# EAGLE schematic EK-TM4C1294XL REV D-shield (EAGLE 6.5.0)

## Sheet 1 of 2: BoosterPack Interface
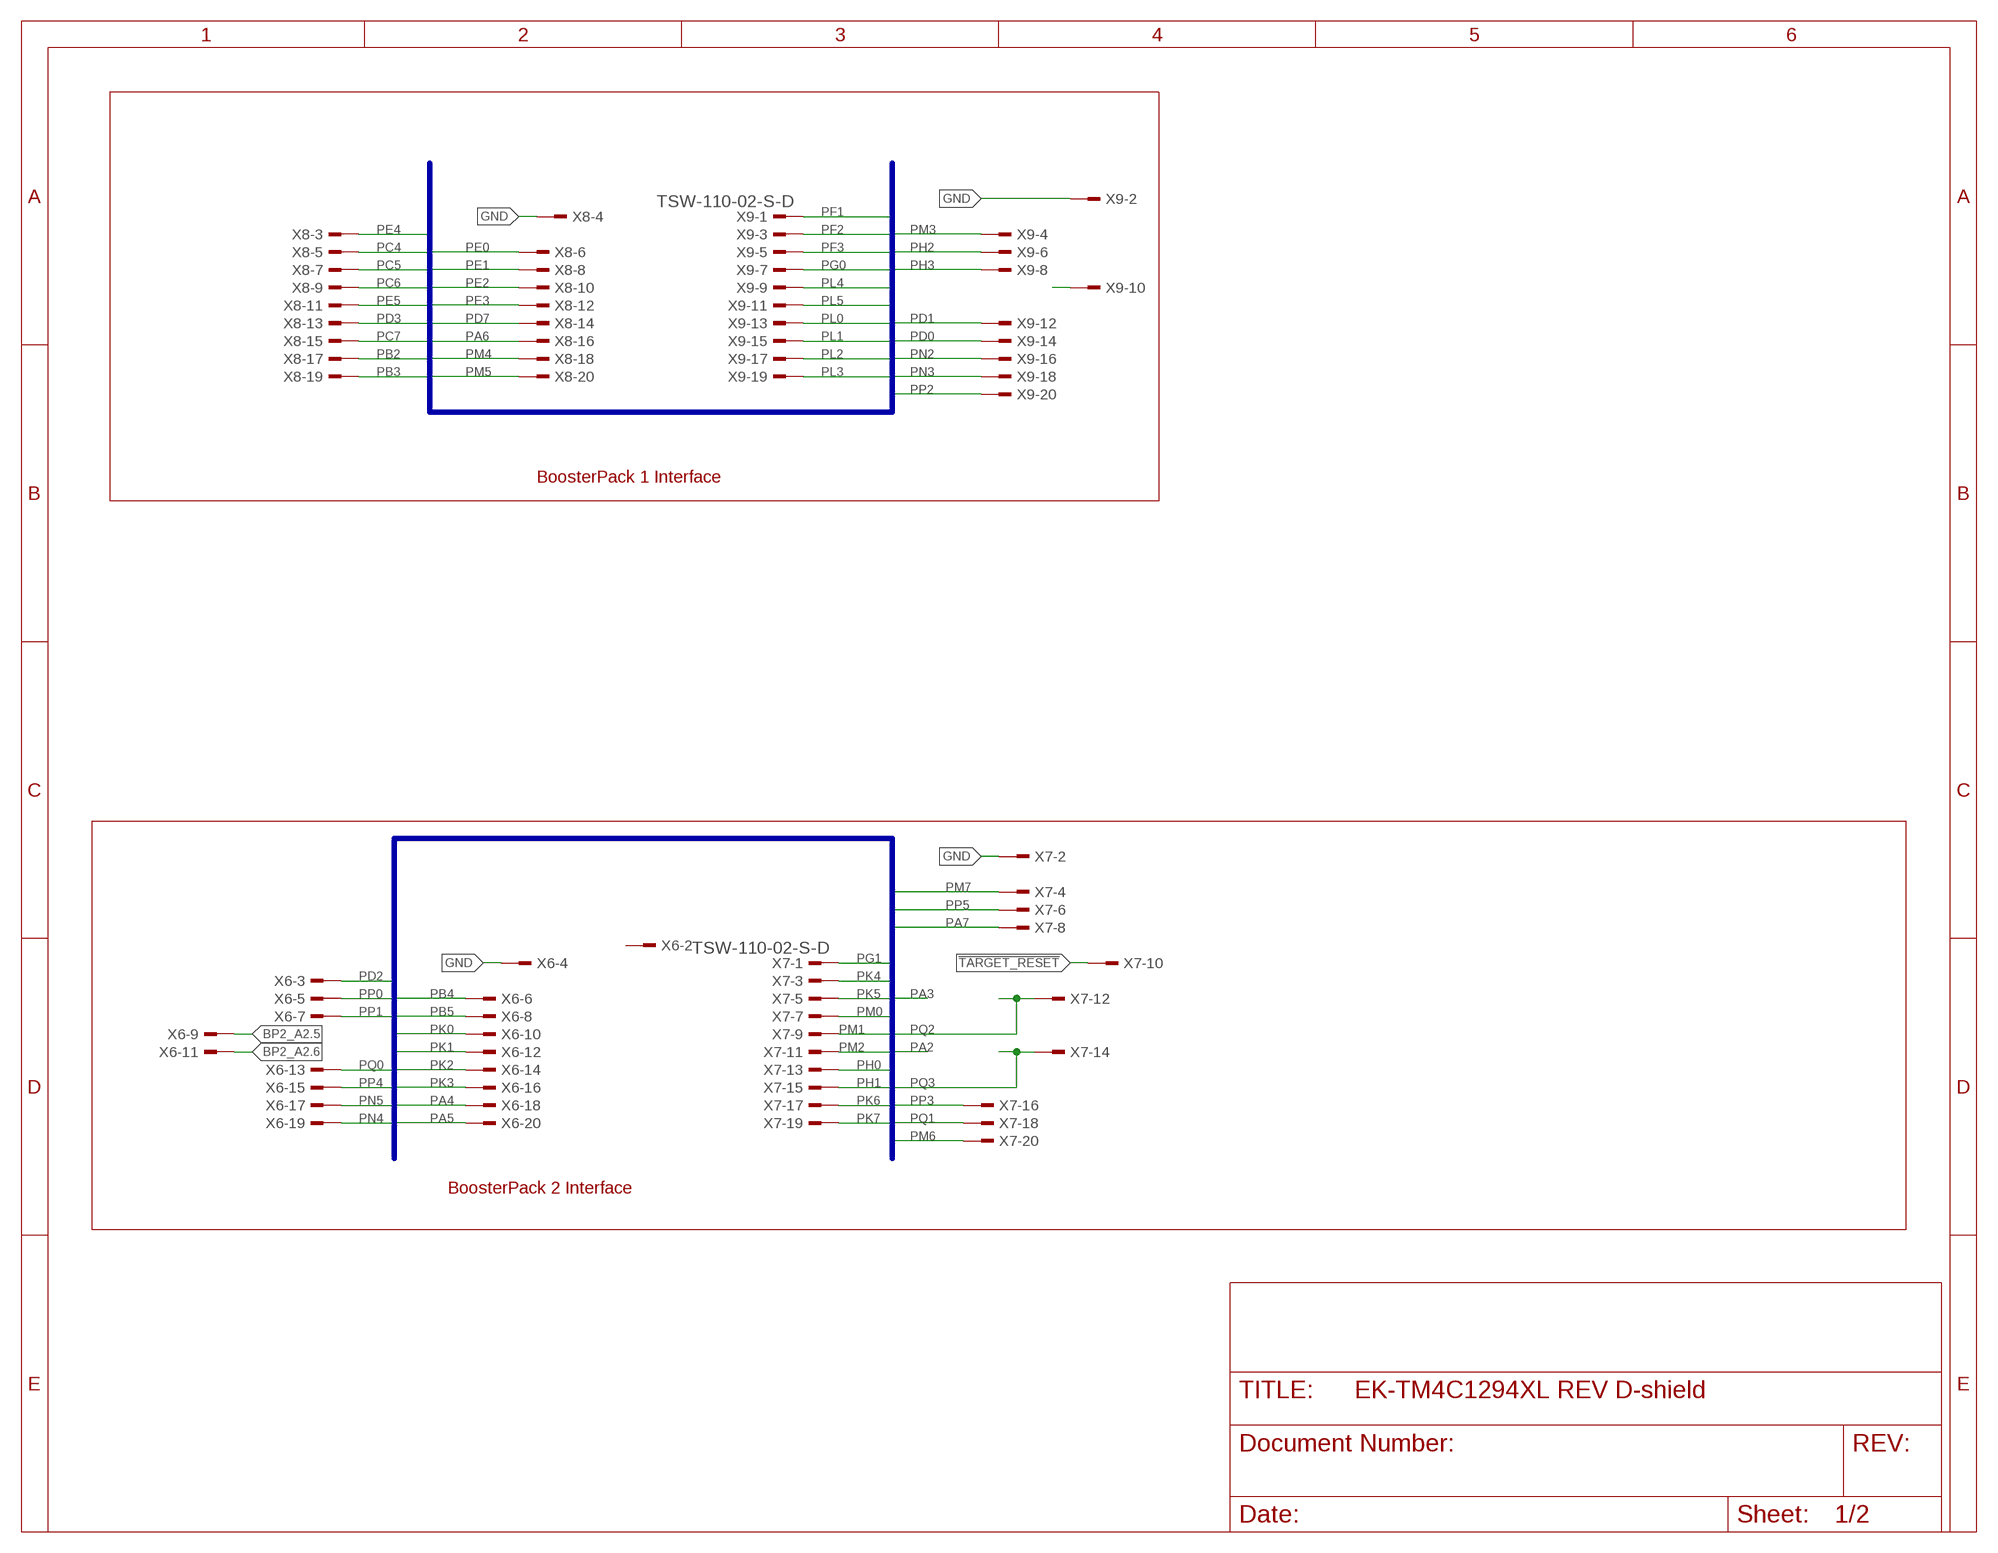
[diagram p0: schematic, sheet 1]

### Parts
X6  TSW-110-02-S-D  [TSW-110-02-S-D]
X7  TSW-110-02-S-D  [TSW-110-02-S-D]
X8  TSW-110-02-S-D  [TSW-110-02-S-D]
X9  TSW-110-02-S-D  [TSW-110-02-S-D]

### Nets
!TARGET_RESET: X7.10 X9.10
BP2_A2.5: X6.9
BP2_A2.6: X6.11
GND: X6.4 X7.2 X8.4 X9.2
PA4: X6.18
PA5: X6.20
PA6: X8.16
PA7: X7.8
PB2: X8.17
PB3: X8.19
PB4: X6.6
PB5: X6.8
PC4: X8.5
PC5: X8.7
PC6: X8.9
PC7: X8.15
PD0: X9.14
PD1: X9.12
PD2: X6.3
PD3: X8.13
PD7: X8.14
PE0: X8.6
PE1: X8.8
PE2: X8.10
PE3: X8.12
PE4: X8.3
PE5: X8.11
PF1: X9.1
PF2: X9.3
PF3: X9.5
PG0: X9.7
PG1: X7.1
PH0: X7.13
PH1: X7.15
PH2: X9.6
PH3: X9.8
PK0: X6.10
PK1: X6.12
PK2: X6.14
PK3: X6.16
PK4: X7.3
PK5: X7.5
PK6: X7.17
PK7: X7.19
PL0: X9.13
PL1: X9.15
PL2: X9.17
PL3: X9.19
PL4: X9.9
PL5: X9.11
PM0: X7.7
PM1: X7.9
PM2: X7.11
PM3: X9.4
PM4: X8.18
PM5: X8.20
PM6: X7.20
PM7: X7.4
PN2: X9.16
PN3: X9.18
PN4: X6.19
PN5: X6.17
PP0: X6.5
PP1: X6.7
PP2: X9.20
PP3: X7.16
PP4: X6.15
PP5: X7.6
PQ0: X6.13
PQ1: X7.18
PQ2: X7.12
PQ3: X7.14
Unconnected: X6.1 X6.2 X8.1 X8.2

### Buses
GPIO:PA[0..7],PB[0..5],PC[0..7],PD[0..7],PE[0..5],PF[0..4],PG[0..1],PH[0..3],PJ[0..1],PK[0..7],PL[0..7],PM[0..7],PN[0..5],PP[0..5],PQ[0..4]

### Notes on the sheet
- BoosterPack 1 Interface
- BoosterPack 2 Interface

## Sheet 2 of 2: Power
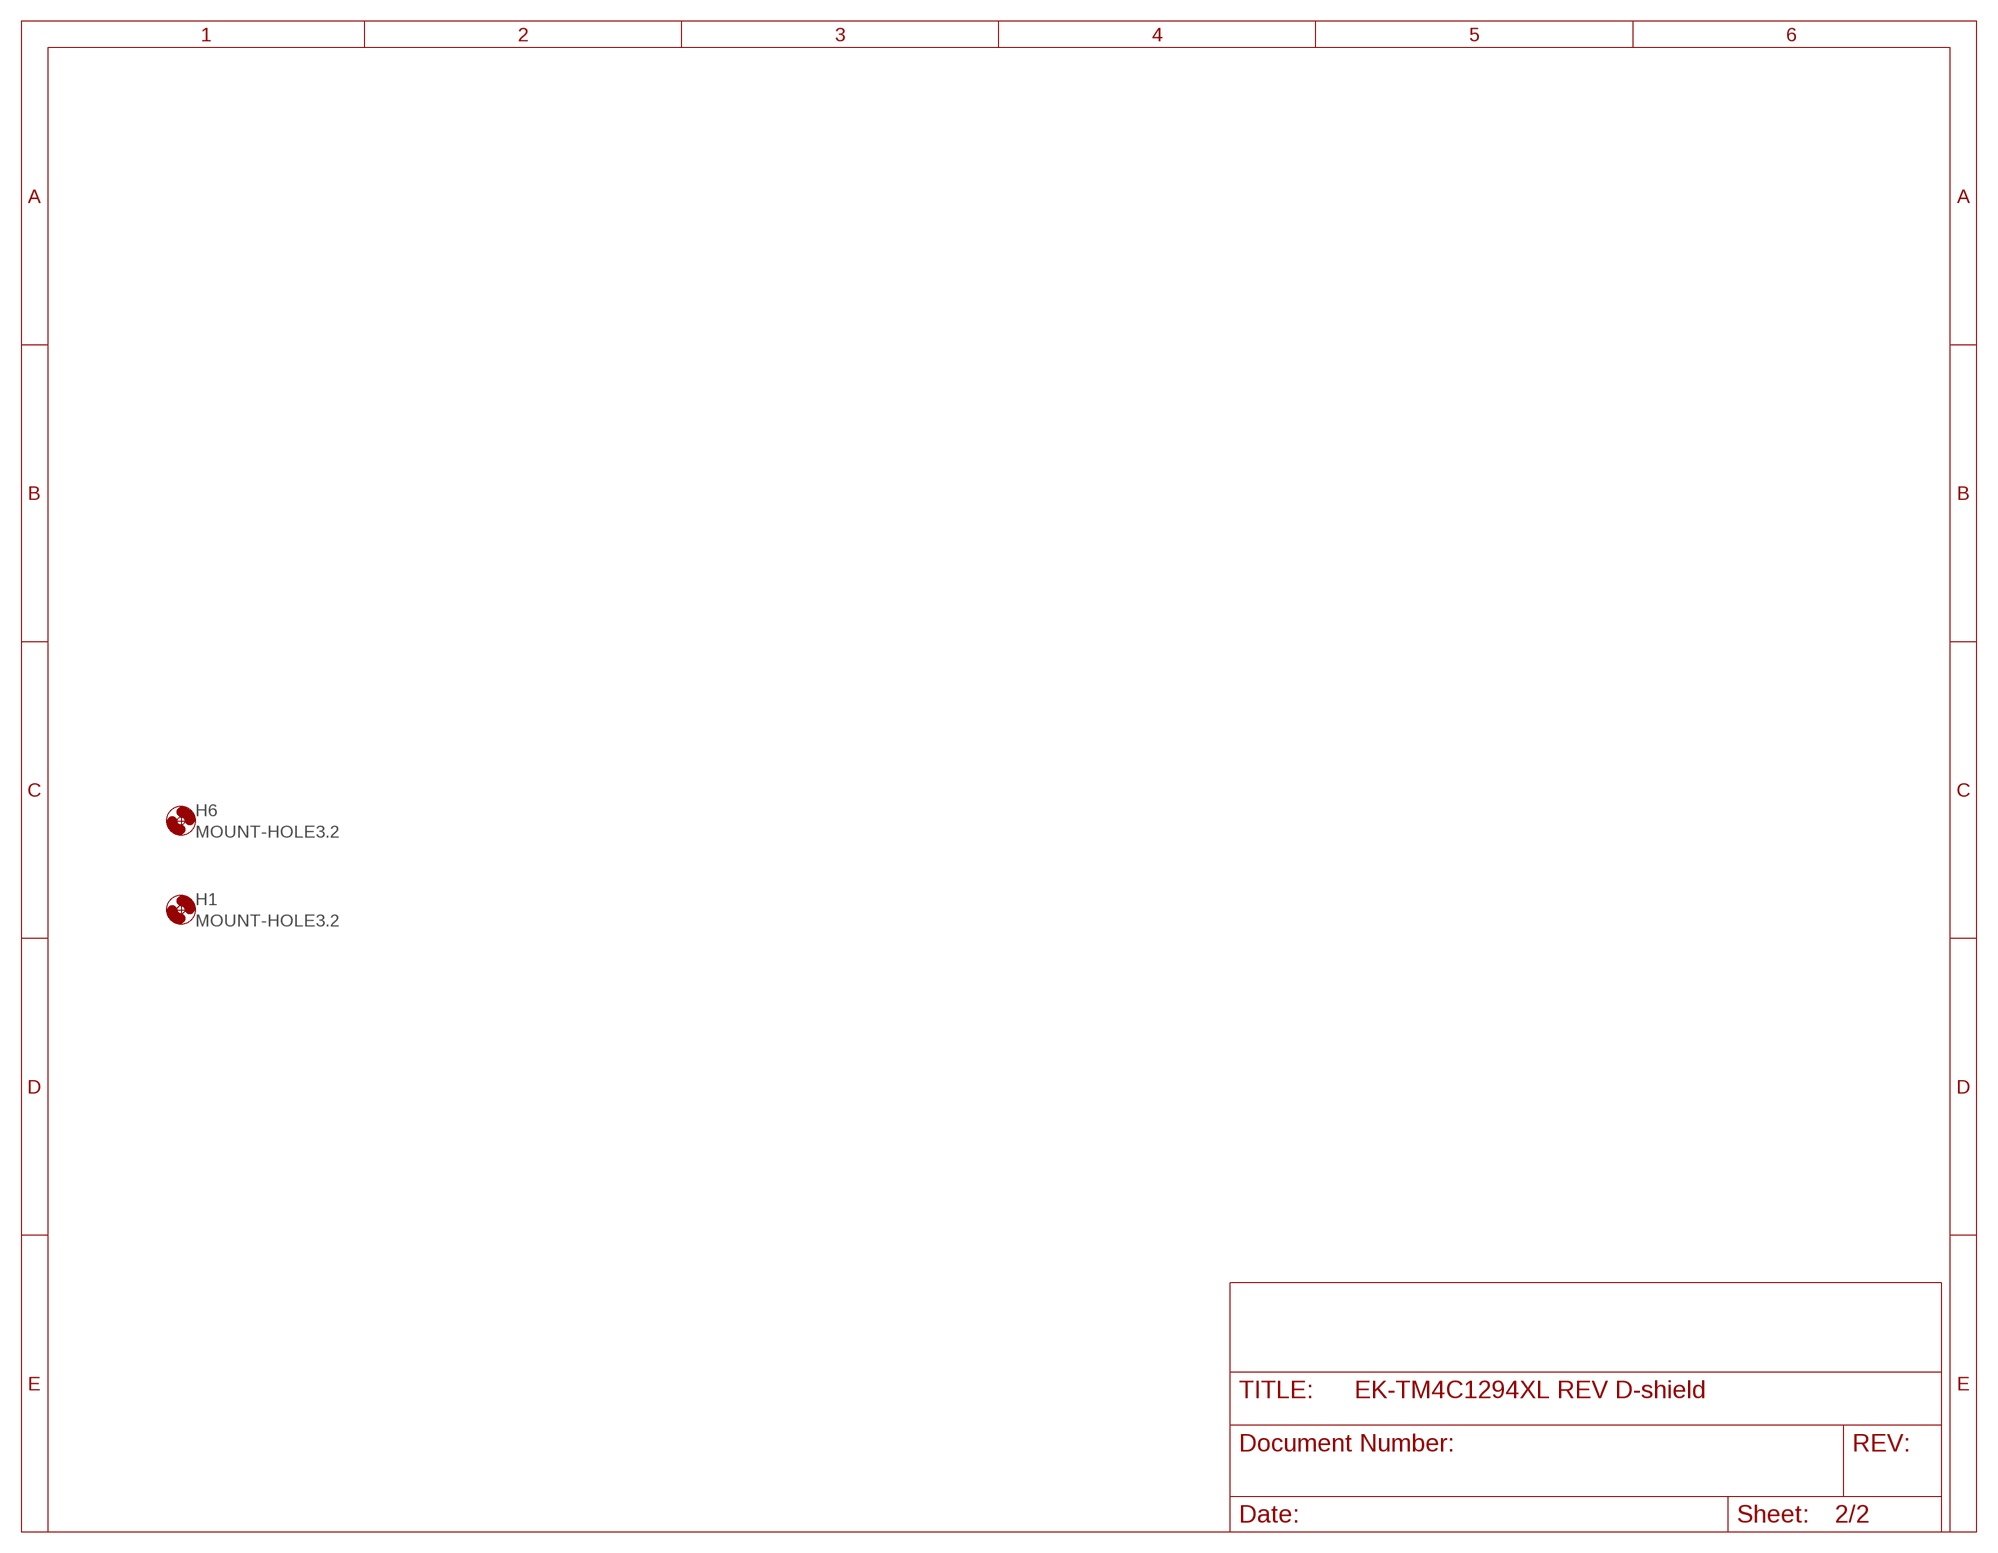
[diagram p1: schematic, sheet 2]

### Parts
H1  MOUNT-HOLE3.2  [3,2]
H6  MOUNT-HOLE3.2  [3,2]

## Library data of the parts
H1 H6 = holes:MOUNT-HOLE: MOUNTING HOLE with drill center marker; GNUM: G30-62S04-A112-AAA; POPOP: OMIT
X6-X9 = ek-tm4c129exl:TSW-110-02-S-D: THROUGH-HOLE .025" SQ POST HEADER Source: Samtec TSW.pdf; GNUM: G22-THSTK-2X10-BAC; OC_FARNELL: unknown; OC_NEWARK: unknown

## Net classes
1 USB: width 0.275 mm, clearance 0.152 mm
2 Ethernet: width 0.22 mm, clearance 0.152 mm